# Altium project STM32F407Z.PrjPcb
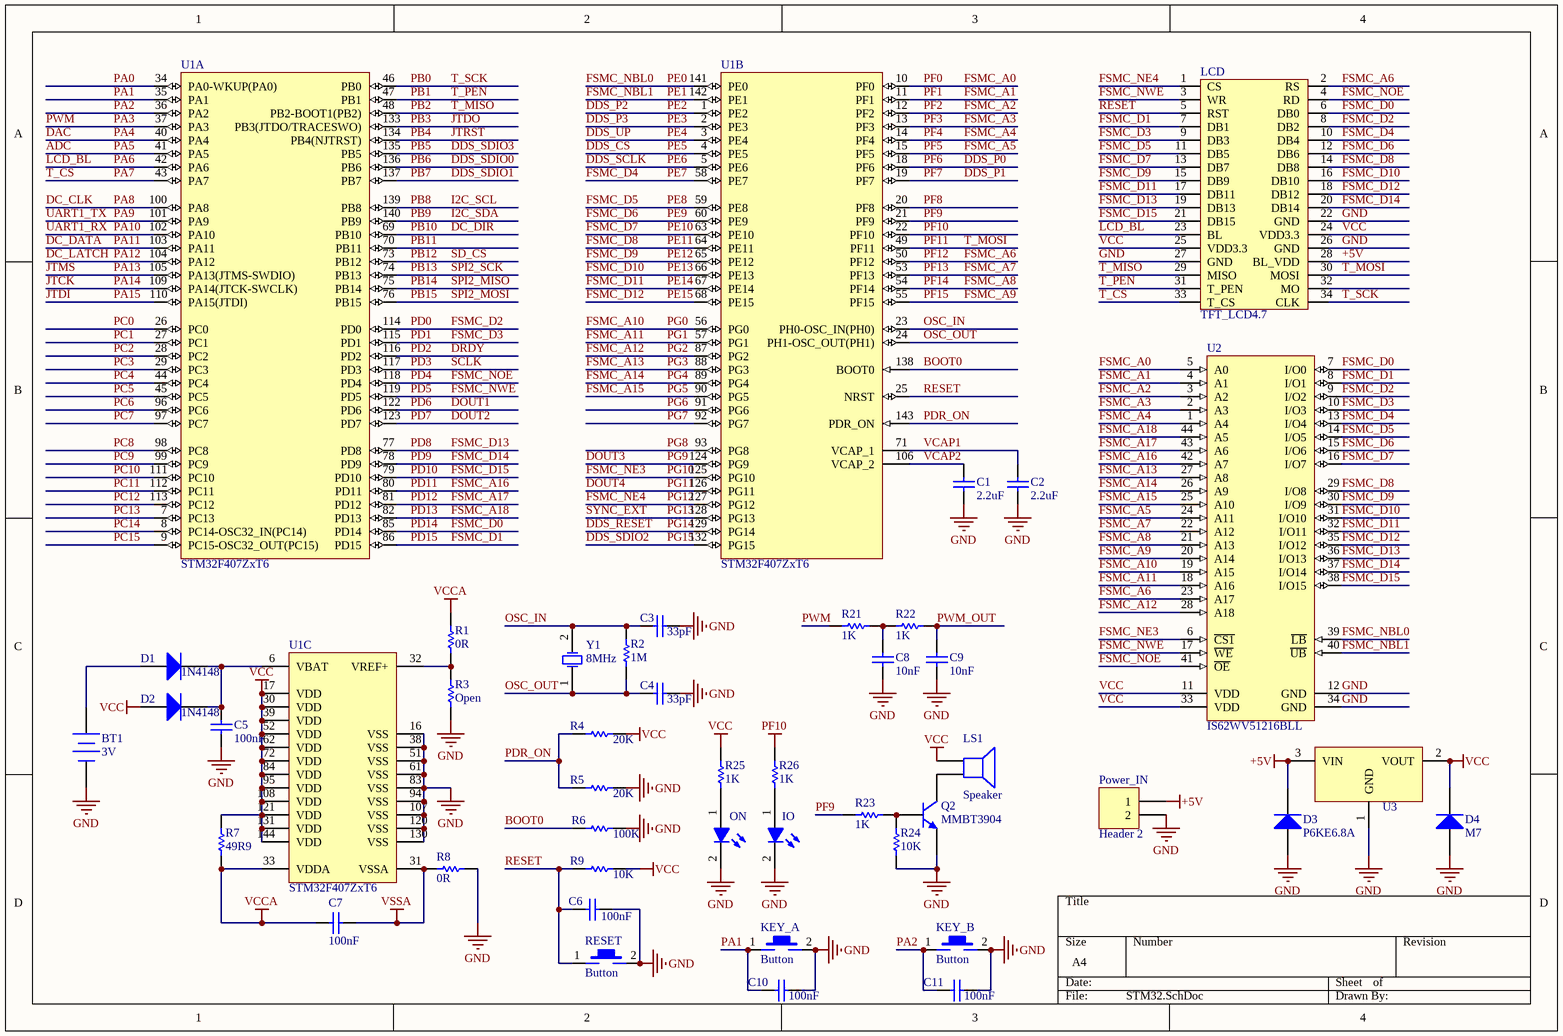
[diagram p0: STM32.SchDoc]
3 sheets, 103 parts. Net scope: global (net labels, ports and power ports of the same name join across sheets).
Board file: F407Z.PcbDoc
Sheets:
  STM32.SchDoc
  Ports.SchDoc
  Decoupling CAP.SchDoc

## Sheet STM32.SchDoc
size A4

### Parts
BT1  3V  [BAT-2]
C1  2.2uF  [CAPC0603(1608)55_M]
C2  2.2uF  [CAPC0603(1608)55_M]
C3  33pF  [CAPC0603(1608)55_M]
C4  33pF  [CAPC0603(1608)55_M]
C5  100nF  [CAPC0603(1608)55_M]
C6  100nF  [CAPC0603(1608)55_M]
C7  100nF  [CAPC0603(1608)55_M]
C8  10nF  [CAPC0603(1608)55_M]
C9  10nF  [CAPC0603(1608)55_M]
C10  100nF  [CAPC0603(1608)55_M]
C11  100nF  [CAPC0603(1608)55_M]
D1  1N4148  [LL34]
D2  1N4148  [LL34]
D3  P6KE6.8A  [DO-214AC]
D4  M7  [DO-214AC]
IO  LED-BLUE  [0603LED_BLUE_V]  (value not drawn)
KEY_A  Button  [Button665]
KEY_B  Button  [Button665]
LCD  TFT_LCD4.7  [DB2*17-3.5]
LS1  Speaker  [Buzzer]
ON  LED-BLUE  [0603LED_BLUE_V]  (value not drawn)
Power_IN  Header 2  [VH3.96-2-AW]
Q2  MMBT3904  [SOT23_M]
R1  0R  [RESC0603(1608)_M]
R2  1M  [RESC0603(1608)_M]
R3  Open  [RESC0603(1608)_M]
R4  20K  [RESC0603(1608)_M]
R5  20K  [RESC0603(1608)_M]
R6  100K  [RESC0603(1608)_M]
R7  49R9  [RESC0603(1608)_M]
R8  0R  [RESC0603(1608)_M]
R9  10K  [RESC0603(1608)_M]
R21  1K  [RESC0603(1608)_M]
R22  1K  [RESC0603(1608)_M]
R23  1K  [RESC0603(1608)_M]
R24  10K  [RESC0603(1608)_M]
R25  1K  [RESC0603(1608)_M]
R26  1K  [RESC0603(1608)_M]
RESET  Button  [Button665]
U1  STM32F407ZxT6  [LQFP144]  (parts A,B,C of 3)
U2  IS62WV51216BLL  [TSOP-2-44]
U3  AMS1117  [SOT-223_M]  (value not drawn)
Y1  8MHz  [HC-49S]

### Nets
+5V: D3.1(K) LCD.28(BL_VDD) Power_IN.1 U3.3(VIN)
GND: BT1.2(-) C1.1 C2.1 C3.2 C4.2 C5.2 C6.2 C8.1 C9.1 C10.2 C11.2 D3.2(A) D4.2(A) IO.2(K) KEY_A.2 KEY_B.2 LCD.22(GND) LCD.26(GND) LCD.27(GND) ON.2(K) Power_IN.2 Q2.2(E) R3.1 R5.1 R6.2 R8.2 R24.1 RESET.2 U1.16(VSS) U1.38(VSS) U1.51(VSS) U1.61(VSS) U1.83(VSS) U1.94(VSS) U1.107(VSS) U1.120(VSS) U1.130(VSS) U2.12(GND) U2.34(GND) U3.1(GND)
PF10: R26.2 U1.22(PF10)
VCC: D2.2(A) D4.1(K) LCD.24(VDD3.3) LCD.25(VDD3.3) LS1.1 R4.1 R7.2 R9.2 R25.2 U1.17(VDD) U1.30(VDD) U1.39(VDD) U1.52(VDD) U1.62(VDD) U1.72(VDD) U1.84(VDD) U1.95(VDD) U1.108(VDD) U1.121(VDD) U1.131(VDD) U1.144(VDD) U2.11(VDD) U2.33(VDD) U3.2(VOUT)
VCCA: C7.2 R1.2 R7.1 U1.33(VDDA)
VSSA: C7.1 R8.1 U1.31(VSSA)
ADC: U1.41(PA5)  [also labelled PA5]
BOOT0: R6.1 U1.138(BOOT0)
DAC: U1.40(PA4)  [also labelled PA4]
DC_CLK: U1.100(PA8)  [also labelled PA8]
DC_DATA: U1.103(PA11)  [also labelled PA11]
DC_DIR: U1.69(PB10)  [also labelled PB10]
DC_LATCH: U1.104(PA12)  [also labelled PA12]
DDS_CS: U1.4(PE5)  [also labelled PE5]
DDS_P0: U1.18(PF6)  [also labelled PF6]
DDS_P1: U1.19(PF7)  [also labelled PF7]
DDS_P2: U1.1(PE2)  [also labelled PE2]
DDS_P3: U1.2(PE3)  [also labelled PE3]
DDS_RESET: U1.129(PG14)  [also labelled PG14]
DDS_SCLK: U1.5(PE6)  [also labelled PE6]
DDS_SDIO0: U1.136(PB6)  [also labelled PB6]
DDS_SDIO1: U1.137(PB7)  [also labelled PB7]
DDS_SDIO2: U1.132(PG15)  [also labelled PG15]
DDS_SDIO3: U1.135(PB5)  [also labelled PB5]
DDS_UP: U1.3(PE4)  [also labelled PE4]
DOUT1: U1.122(PD6)  [also labelled PD6]
DOUT2: U1.123(PD7)  [also labelled PD7]
DOUT3: U1.124(PG9)  [also labelled PG9]
DOUT4: U1.126(PG11)  [also labelled PG11]
DRDY: U1.116(PD2)  [also labelled PD2]
FSMC_A0: U1.10(PF0) U2.5(A0)  [also labelled PF0]
FSMC_A1: U1.11(PF1) U2.4(A1)  [also labelled PF1]
FSMC_A2: U1.12(PF2) U2.3(A2)  [also labelled PF2]
FSMC_A3: U1.13(PF3) U2.2(A3)  [also labelled PF3]
FSMC_A4: U1.14(PF4) U2.1(A4)  [also labelled PF4]
FSMC_A5: U1.15(PF5) U2.24(A11)  [also labelled PF5]
FSMC_A6: LCD.2(RS) U1.50(PF12) U2.23(A17)  [also labelled PF12]
FSMC_A7: U1.53(PF13) U2.22(A12)  [also labelled PF13]
FSMC_A8: U1.54(PF14) U2.21(A13)  [also labelled PF14]
FSMC_A9: U1.55(PF15) U2.20(A14)  [also labelled PF15]
FSMC_A10: U1.56(PG0) U2.19(A15)  [also labelled PG0]
FSMC_A11: U1.57(PG1) U2.18(A16)  [also labelled PG1]
FSMC_A12: U1.87(PG2) U2.28(A18)  [also labelled PG2]
FSMC_A13: U1.88(PG3) U2.27(A8)  [also labelled PG3]
FSMC_A14: U1.89(PG4) U2.26(A9)  [also labelled PG4]
FSMC_A15: U1.90(PG5) U2.25(A10)  [also labelled PG5]
FSMC_A16: U1.80(PD11) U2.42(A7)  [also labelled PD11]
FSMC_A17: U1.81(PD12) U2.43(A6)  [also labelled PD12]
FSMC_A18: U1.82(PD13) U2.44(A5)  [also labelled PD13]
FSMC_D0: LCD.6(DB0) U1.85(PD14) U2.7(I/O0)  [also labelled PD14]
FSMC_D1: LCD.7(DB1) U1.86(PD15) U2.8(I/O1)  [also labelled PD15]
FSMC_D2: LCD.8(DB2) U1.114(PD0) U2.9(I/O2)  [also labelled PD0]
FSMC_D3: LCD.9(DB3) U1.115(PD1) U2.10(I/O3)  [also labelled PD1]
FSMC_D4: LCD.10(DB4) U1.58(PE7) U2.13(I/O4)  [also labelled PE7]
FSMC_D5: LCD.11(DB5) U1.59(PE8) U2.14(I/O5)  [also labelled PE8]
FSMC_D6: LCD.12(DB6) U1.60(PE9) U2.15(I/O6)  [also labelled PE9]
FSMC_D7: LCD.13(DB7) U1.63(PE10) U2.16(I/O7)  [also labelled PE10]
FSMC_D8: LCD.14(DB8) U1.64(PE11) U2.29(I/O8)  [also labelled PE11]
FSMC_D9: LCD.15(DB9) U1.65(PE12) U2.30(I/O9)  [also labelled PE12]
FSMC_D10: LCD.16(DB10) U1.66(PE13) U2.31(I/O10)  [also labelled PE13]
FSMC_D11: LCD.17(DB11) U1.67(PE14) U2.32(I/O11)  [also labelled PE14]
FSMC_D12: LCD.18(DB12) U1.68(PE15) U2.35(I/O12)  [also labelled PE15]
FSMC_D13: LCD.19(DB13) U1.77(PD8) U2.36(I/O13)  [also labelled PD8]
FSMC_D14: LCD.20(DB14) U1.78(PD9) U2.37(I/O14)  [also labelled PD9]
FSMC_D15: LCD.21(DB15) U1.79(PD10) U2.38(I/O15)  [also labelled PD10]
FSMC_NBL0: U1.141(PE0) U2.39(~{LB})  [also labelled PE0]
FSMC_NBL1: U1.142(PE1) U2.40(~{UB})  [also labelled PE1]
FSMC_NE3: U1.125(PG10) U2.6(~{CS1})  [also labelled PG10]
FSMC_NE4: LCD.1(CS) U1.127(PG12)  [also labelled PG12]
FSMC_NOE: LCD.4(RD) U1.118(PD4) U2.41(~{OE})  [also labelled PD4]
FSMC_NWE: LCD.3(WR) U1.119(PD5) U2.17(~{WE})  [also labelled PD5]
I2C_SCL: U1.139(PB8)  [also labelled PB8]
I2C_SDA: U1.140(PB9)  [also labelled PB9]
JTCK: U1.109(PA14(JTCK-SWCLK))  [also labelled PA14]
JTDI: U1.110(PA15(JTDI))  [also labelled PA15]
JTDO: U1.133(PB3(JTDO/TRACESWO))  [also labelled PB3]
JTMS: U1.105(PA13(JTMS-SWDIO))  [also labelled PA13]
JTRST: U1.134(PB4(NJTRST))  [also labelled PB4]
LCD_BL: LCD.23(BL) U1.42(PA6)  [also labelled PA6]
OSC_IN: C3.1 R2.2 U1.23(PH0-OSC_IN(PH0)) Y1.2(OSC2)
OSC_OUT: C4.1 R2.1 U1.24(PH1-OSC_OUT(PH1)) Y1.1(OSC1)
PA0: U1.34(PA0-WKUP(PA0))
PA1: C10.1 KEY_A.1 U1.35(PA1)
PA2: C11.1 KEY_B.1 U1.36(PA2)
PA3: R21.1 U1.37(PA3)  [also labelled PWM]
PA7: LCD.33(T_CS) U1.43(PA7)  [also labelled T_CS]
PA9: U1.101(PA9)  [also labelled UART1_TX]
PA10: U1.102(PA10)  [also labelled UART1_RX]
PB0: LCD.34(CLK) U1.46(PB0)  [also labelled T_SCK]
PB1: LCD.31(T_PEN) U1.47(PB1)  [also labelled T_PEN]
PB2: LCD.29(MISO) U1.48(PB2-BOOT1(PB2))  [also labelled T_MISO]
PB11: U1.70(PB11)
PB12: U1.73(PB12)  [also labelled SD_CS]
PB13: U1.74(PB13)  [also labelled SPI2_SCK]
PB14: U1.75(PB14)  [also labelled SPI2_MISO]
PB15: U1.76(PB15)  [also labelled SPI2_MOSI]
PC0: U1.26(PC0)
PC1: U1.27(PC1)
PC2: U1.28(PC2)
PC3: U1.29(PC3)
PC4: U1.44(PC4)
PC5: U1.45(PC5)
PC6: U1.96(PC6)
PC7: U1.97(PC7)
PC8: U1.98(PC8)
PC9: U1.99(PC9)
PC10: U1.111(PC10)
PC11: U1.112(PC11)
PC12: U1.113(PC12)
PC13: U1.7(PC13)
PC14: U1.8(PC14-OSC32_IN(PC14))
PC15: U1.9(PC15-OSC32_OUT(PC15))
PD3: U1.117(PD3)  [also labelled SCLK]
PDR_ON: R4.2 R5.2 U1.143(PDR_ON)
PF8: U1.20(PF8)
PF9: R23.1 U1.21(PF9)
PF11: LCD.30(MOSI) U1.49(PF11)  [also labelled T_MOSI]
PG6: U1.91(PG6)
PG7: U1.92(PG7)
PG8: U1.93(PG8)
PG13: U1.128(PG13)  [also labelled SYNC_EXT]
PWM_OUT: C9.2 R22.2
RESET: C6.1 LCD.5(RST) R9.1 RESET.1 U1.25(NRST)
VCAP1: C2.2 U1.71(VCAP_1)
VCAP2: C1.2 U1.106(VCAP_2)
NetBT1_1: BT1.1(+) D1.2(A)
NetC5_1: C5.1 D1.1(K) D2.1(K) U1.6(VBAT)
NetC8_2: C8.2 R21.2 R22.1
NetIO_1: IO.1(A) R26.1
NetLS1_2: LS1.2 Q2.3(C)
NetON_1: ON.1(A) R25.1
NetQ2_1: Q2.1(B) R23.2 R24.2
NetR1_1: R1.1 R3.2 U1.32(VREF+)

Not connected (* = marked no-connect by the designer): LCD 32(MO)

### Library data of the parts
BT1 = Battery: Multicell Battery; Published: 24-Mar-1999; LatestRevisionDate: 17-Jul-2002; LatestRevisionNote: Re-released for DXP Platform.; PackageReference: BAT-2; Publisher: Altium Limited; PackageDescription: Battery; 2 Leads
C1-C11 = CAP
D1-D4 = Diode: pin to pad: 1>2 2>1
LS1 = Speaker: Loudspeaker; Published: 24-Mar-1999; LatestRevisionDate: 17-Jul-2002; LatestRevisionNote: Re-released for DXP Platform.; PackageReference: PIN2; Publisher: Altium Limited
Power_IN = Header 2: Header, 2-Pin; LatestRevisionDate: 17-Jul-2002; LatestRevisionNote: Re-released for DXP Platform.; Publisher: Altium Limited
Q2 = MMBT3904: NPN General Purpose Amplifier; Published: 8-Jun-2000; LatestRevisionDate: 15-Jan-2003; LatestRevisionNote: PCB Footprint 'BCY-W3/D4.7' replaced; DatasheetVersion: 1997; PackageVersion: Sep-1998; PackageReference: TO-92A; Publisher: Altium Limited; PackageDescription: TO, Flat Index; 3 In-Line, Axial Leads; Body Dia. 4.5mm; Leads 0.51 x 0.48 mm (max); ComponentLink1Description: Manufacturer Link; ComponentLink1URL: http://www.fairchildsemi.com/; ComponentLink2Description: Datasheet; ComponentLink2URL: http://www.fairchildsemi.com/ds/2N%2F2N3904.pdf
R1-R9 R21-R26 = RES
Y1 = XTAL: Crystal Oscillator; Published: 8-Jun-2000; LatestRevisionDate: 17-Jul-2002; LatestRevisionNote: Re-released for DXP Platform.; PackageReference: R38; Publisher: Altium Limited; PackageDescription: Crystal, Thru-Hole; 2 Leads; Body 3.1 x 8.2 mm (Dia.xH)

## Sheet Ports.SchDoc
size A4
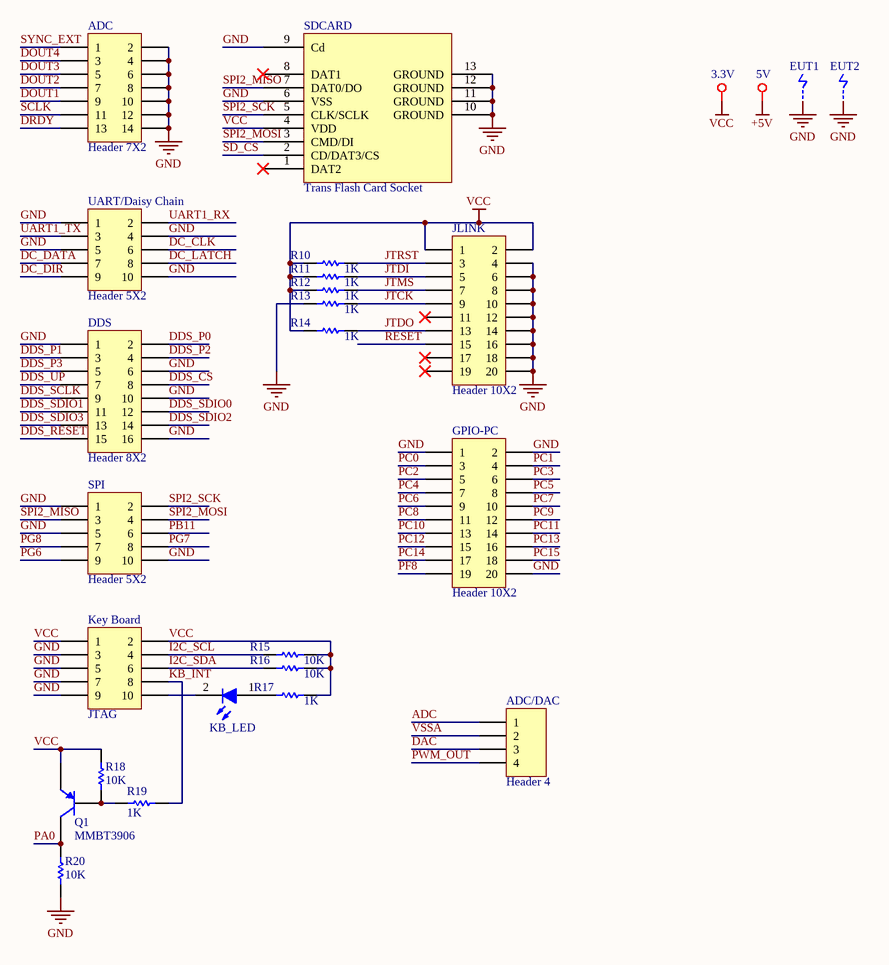
[diagram p1: Ports.SchDoc]

### Parts
3.3V  TestPoint  [TestHole]  (value not drawn)
5V  TestPoint  [TestHole]  (value not drawn)
ADC  Header 7X2  [HEADER7X2]
ADC/DAC  Header 4  [HDR1X4]
DDS  Header 8X2  [HEADER8X2]
EUT1  EUT  [EUT]  (value not drawn)
EUT2  EUT  [EUT]  (value not drawn)
GPIO-PC  Header 10X2  [HEADER 10X2]
JLINK  Header 10X2  [HEADER 10X2]
KB_LED  LED-BLUE  [0603LED_BLUE_V]  (value not drawn)
Key_Board  JTAG  [HEADER5X2]
Q1  MMBT3906  [SOT23_M]
R10  1K  [RESC0603(1608)_M]
R11  1K  [RESC0603(1608)_M]
R12  1K  [RESC0603(1608)_M]
R13  1K  [RESC0603(1608)_M]
R14  1K  [RESC0603(1608)_M]
R15  10K  [RESC0603(1608)_M]
R16  10K  [RESC0603(1608)_M]
R17  1K  [RESC0603(1608)_M]
R18  10K  [RESC0603(1608)_M]
R19  1K  [RESC0603(1608)_M]
R20  10K  [RESC0603(1608)_M]
SDCARD  Trans Flash Card Socket  [TF Card]
SPI  Header 5X2  [HEADER5X2]
UART/Daisy_Chain  Header 5X2  [HEADER5X2]

### Nets
+5V: 5V.1
GND: ADC.2 ADC.4 ADC.6 ADC.8 ADC.10 ADC.12 ADC.14 DDS.1 DDS.6 DDS.10 DDS.16 EUT1.2 EUT2.2 GPIO-PC.1 GPIO-PC.2 GPIO-PC.20 JLINK.4 JLINK.6 JLINK.8 JLINK.10 JLINK.12 JLINK.14 JLINK.16 JLINK.18 JLINK.20 Key_Board.3 Key_Board.5 Key_Board.7 Key_Board.9 R13.1 R20.1 SDCARD.6(VSS) SDCARD.9(Cd) SDCARD.10(GROUND) SDCARD.11(GROUND) SDCARD.12(GROUND) SDCARD.13(GROUND) SPI.1 SPI.5 SPI.10 UART/Daisy_Chain.1 UART/Daisy_Chain.4 UART/Daisy_Chain.5 UART/Daisy_Chain.10
VCC: 3.3V.1 JLINK.1 JLINK.2 Key_Board.1 Key_Board.2 Q1.2(E) R10.1 R11.1 R12.1 R14.1 R15.2 R16.2 R17.2 R18.2 SDCARD.4(VDD)
VSSA: ADC/DAC.2
ADC: ADC/DAC.1
DAC: ADC/DAC.3
DC_CLK: UART/Daisy_Chain.6
DC_DATA: UART/Daisy_Chain.7
DC_DIR: UART/Daisy_Chain.9
DC_LATCH: UART/Daisy_Chain.8
DDS_CS: DDS.8
DDS_P0: DDS.2
DDS_P1: DDS.3
DDS_P2: DDS.4
DDS_P3: DDS.5
DDS_RESET: DDS.15
DDS_SCLK: DDS.9
DDS_SDIO0: DDS.12
DDS_SDIO1: DDS.11
DDS_SDIO2: DDS.14
DDS_SDIO3: DDS.13
DDS_UP: DDS.7
DOUT1: ADC.9
DOUT2: ADC.7
DOUT3: ADC.5
DOUT4: ADC.3
DRDY: ADC.13
I2C_SCL: Key_Board.4 R15.1
I2C_SDA: Key_Board.6 R16.1
JTCK: JLINK.9 R13.2
JTDI: JLINK.5 R11.2
JTDO: JLINK.13 R14.2
JTMS: JLINK.7 R12.2
JTRST: JLINK.3 R10.2
KB_INT: Key_Board.8 R19.2
PA0: Q1.3(C) R20.2
PB11: SPI.6
PC0: GPIO-PC.3
PC1: GPIO-PC.4
PC2: GPIO-PC.5
PC3: GPIO-PC.6
PC4: GPIO-PC.7
PC5: GPIO-PC.8
PC6: GPIO-PC.9
PC7: GPIO-PC.10
PC8: GPIO-PC.11
PC9: GPIO-PC.12
PC10: GPIO-PC.13
PC11: GPIO-PC.14
PC12: GPIO-PC.15
PC13: GPIO-PC.16
PC14: GPIO-PC.17
PC15: GPIO-PC.18
PF8: GPIO-PC.19
PG6: SPI.9
PG7: SPI.8
PG8: SPI.7
PWM_OUT: ADC/DAC.4
RESET: JLINK.15
SCLK: ADC.11  [project net PD3]
SD_CS: SDCARD.2(CD/DAT3/CS)  [project net PB12]
SPI2_MISO: SDCARD.7(DAT0/DO) SPI.3  [project net PB14]
SPI2_MOSI: SDCARD.3(CMD/DI) SPI.4  [project net PB15]
SPI2_SCK: SDCARD.5(CLK/SCLK) SPI.2  [project net PB13]
SYNC_EXT: ADC.1  [project net PG13]
UART1_RX: UART/Daisy_Chain.2  [project net PA10]
UART1_TX: UART/Daisy_Chain.3  [project net PA9]
NetKB_LED_1: KB_LED.1(A) R17.1
NetKB_LED_2: KB_LED.2(K) Key_Board.10
NetQ1_1: Q1.1(B) R18.1 R19.1

Not connected (* = marked no-connect by the designer): JLINK 11* 17* 19*; SDCARD 1(DAT2)* 8(DAT1)*

### Library data of the parts
ADC = Header 7X2: Header, 7-Pin, Dual row; LatestRevisionDate: 17-Jul-2002; LatestRevisionNote: Re-released for DXP Platform.; Publisher: Altium Limited
ADC/DAC = Header 4: Header, 4-Pin; LatestRevisionDate: 17-Jul-2002; LatestRevisionNote: Re-released for DXP Platform.; Publisher: Altium Limited
DDS = Header 8X2: Header, 8-Pin, Dual row; LatestRevisionDate: 17-Jul-2002; LatestRevisionNote: Re-released for DXP Platform.; Publisher: Altium Limited
GPIO-PC JLINK = Header 10X2: Header, 10-Pin, Dual row; LatestRevisionDate: 17-Jul-2002; LatestRevisionNote: Re-released for DXP Platform.; Publisher: Altium Limited
Key_Board = Header 5X2: Header, 5-Pin, Dual row; Manufacturer: Generic Components; Class: Connector
Q1 = MMBT3906: PNP General Purpose Amplifier; Published: 8-Jun-2000; LatestRevisionDate: 15-Jan-2003; LatestRevisionNote: PCB Footprint 'BCY-W3/D4.7' replaced; DatasheetVersion: 1997; PackageVersion: Sep-1998; PackageReference: TO-92A; Publisher: Altium Limited; PackageDescription: TO, Flat Index; 3 In-Line, Axial Leads; Body Dia. 4.5mm; Leads 0.51 x 0.48 mm (max); ComponentLink1Description: Manufacturer Link; ComponentLink1URL: http://www.fairchildsemi.com/; ComponentLink2Description: Datasheet; ComponentLink2URL: http://www.fairchildsemi.com/ds/2N%2F2N3906.pdf
R10-R20 = RES
SDCARD = Trans Flash Card
SPI UART/Daisy_Chain = Header 5X2: Header, 5-Pin, Dual row; LatestRevisionDate: 17-Jul-2002; LatestRevisionNote: Re-released for DXP Platform.; Publisher: Altium Limited

## Sheet Decoupling CAP.SchDoc
size A4
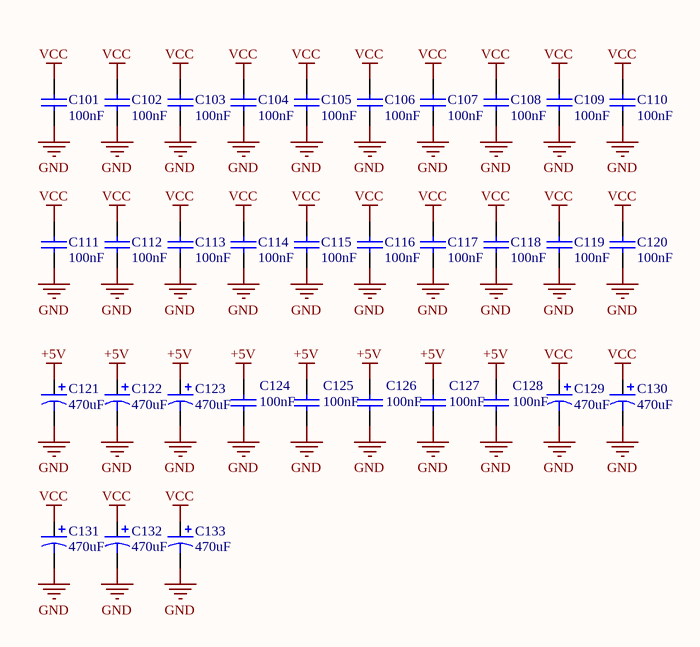
[diagram p2: Decoupling CAP.SchDoc]

### Parts
C101  100nF  [CAPC0603(1608)55_M]
C102  100nF  [CAPC0603(1608)55_M]
C103  100nF  [CAPC0603(1608)55_M]
C104  100nF  [CAPC0603(1608)55_M]
C105  100nF  [CAPC0603(1608)55_M]
C106  100nF  [CAPC0603(1608)55_M]
C107  100nF  [CAPC0603(1608)55_M]
C108  100nF  [CAPC0603(1608)55_M]
C109  100nF  [CAPC0603(1608)55_M]
C110  100nF  [CAPC0603(1608)55_M]
C111  100nF  [CAPC0603(1608)55_M]
C112  100nF  [CAPC0603(1608)55_M]
C113  100nF  [CAPC0603(1608)55_M]
C114  100nF  [CAPC0603(1608)55_M]
C115  100nF  [CAPC0603(1608)55_M]
C116  100nF  [CAPC0603(1608)55_M]
C117  100nF  [CAPC0603(1608)55_M]
C118  100nF  [CAPC0603(1608)55_M]
C119  100nF  [CAPC0603(1608)55_M]
C120  100nF  [CAPC0603(1608)55_M]
C121  470uF  [CAPC7343]
C122  470uF  [CAPC7343]
C123  470uF  [CAPC7343]
C124  100nF  [CAPC0603(1608)55_M]
C125  100nF  [CAPC0603(1608)55_M]
C126  100nF  [CAPC0603(1608)55_M]
C127  100nF  [CAPC0603(1608)55_M]
C128  100nF  [CAPC0603(1608)55_M]
C129  470uF  [CAPC7343]
C130  470uF  [CAPC7343]
C131  470uF  [CAPC7343]
C132  470uF  [CAPC7343]
C133  470uF  [CAPC7343]

### Nets
+5V: C121.1 C122.1 C123.1 C124.2 C125.2 C126.2 C127.2 C128.2
GND: C101.1 C102.1 C103.1 C104.1 C105.1 C106.1 C107.1 C108.1 C109.1 C110.1 C111.1 C112.1 C113.1 C114.1 C115.1 C116.1 C117.1 C118.1 C119.1 C120.1 C121.2 C122.2 C123.2 C124.1 C125.1 C126.1 C127.1 C128.1 C129.2 C130.2 C131.2 C132.2 C133.2
VCC: C101.2 C102.2 C103.2 C104.2 C105.2 C106.2 C107.2 C108.2 C109.2 C110.2 C111.2 C112.2 C113.2 C114.2 C115.2 C116.2 C117.2 C118.2 C119.2 C120.2 C129.1 C130.1 C131.1 C132.1 C133.1

### Library data of the parts
C101-C120 C124-C128 = CAP
C121-C123 C129-C133 = CAP-Pol

## Nets that join several sheets
+5V: STM32 (D3.1 LCD.28 Power_IN.1 U3.3), Ports (5V.1), Decoupling CAP (8 pins)
GND: STM32 (40 pins), Ports (44 pins), Decoupling CAP (33 pins)
VCC: STM32 (24 pins), Ports (15 pins), Decoupling CAP (25 pins)
VSSA: STM32 (C7.1 R8.1 U1.31), Ports (ADC/DAC.2)
ADC: STM32 (U1.41), Ports (ADC/DAC.1)
DAC: STM32 (U1.40), Ports (ADC/DAC.3)
DC_CLK: STM32 (U1.100), Ports (UART/Daisy_Chain.6)
DC_DATA: STM32 (U1.103), Ports (UART/Daisy_Chain.7)
DC_DIR: STM32 (U1.69), Ports (UART/Daisy_Chain.9)
DC_LATCH: STM32 (U1.104), Ports (UART/Daisy_Chain.8)
DDS_CS: STM32 (U1.4), Ports (DDS.8)
DDS_P0: STM32 (U1.18), Ports (DDS.2)
DDS_P1: STM32 (U1.19), Ports (DDS.3)
DDS_P2: STM32 (U1.1), Ports (DDS.4)
DDS_P3: STM32 (U1.2), Ports (DDS.5)
DDS_RESET: STM32 (U1.129), Ports (DDS.15)
DDS_SCLK: STM32 (U1.5), Ports (DDS.9)
DDS_SDIO0: STM32 (U1.136), Ports (DDS.12)
DDS_SDIO1: STM32 (U1.137), Ports (DDS.11)
DDS_SDIO2: STM32 (U1.132), Ports (DDS.14)
DDS_SDIO3: STM32 (U1.135), Ports (DDS.13)
DDS_UP: STM32 (U1.3), Ports (DDS.7)
DOUT1: STM32 (U1.122), Ports (ADC.9)
DOUT2: STM32 (U1.123), Ports (ADC.7)
DOUT3: STM32 (U1.124), Ports (ADC.5)
DOUT4: STM32 (U1.126), Ports (ADC.3)
DRDY: STM32 (U1.116), Ports (ADC.13)
I2C_SCL: STM32 (U1.139), Ports (Key_Board.4 R15.1)
I2C_SDA: STM32 (U1.140), Ports (Key_Board.6 R16.1)
JTCK: STM32 (U1.109), Ports (JLINK.9 R13.2)
JTDI: STM32 (U1.110), Ports (JLINK.5 R11.2)
JTDO: STM32 (U1.133), Ports (JLINK.13 R14.2)
JTMS: STM32 (U1.105), Ports (JLINK.7 R12.2)
JTRST: STM32 (U1.134), Ports (JLINK.3 R10.2)
PA0: STM32 (U1.34), Ports (Q1.3 R20.2)
PA9: STM32 (U1.101), Ports (UART/Daisy_Chain.3)
PA10: STM32 (U1.102), Ports (UART/Daisy_Chain.2)
PB11: STM32 (U1.70), Ports (SPI.6)
PB12: STM32 (U1.73), Ports (SDCARD.2)
PB13: STM32 (U1.74), Ports (SDCARD.5 SPI.2)
PB14: STM32 (U1.75), Ports (SDCARD.7 SPI.3)
PB15: STM32 (U1.76), Ports (SDCARD.3 SPI.4)
PC0: STM32 (U1.26), Ports (GPIO-PC.3)
PC1: STM32 (U1.27), Ports (GPIO-PC.4)
PC2: STM32 (U1.28), Ports (GPIO-PC.5)
PC3: STM32 (U1.29), Ports (GPIO-PC.6)
PC4: STM32 (U1.44), Ports (GPIO-PC.7)
PC5: STM32 (U1.45), Ports (GPIO-PC.8)
PC6: STM32 (U1.96), Ports (GPIO-PC.9)
PC7: STM32 (U1.97), Ports (GPIO-PC.10)
PC8: STM32 (U1.98), Ports (GPIO-PC.11)
PC9: STM32 (U1.99), Ports (GPIO-PC.12)
PC10: STM32 (U1.111), Ports (GPIO-PC.13)
PC11: STM32 (U1.112), Ports (GPIO-PC.14)
PC12: STM32 (U1.113), Ports (GPIO-PC.15)
PC13: STM32 (U1.7), Ports (GPIO-PC.16)
PC14: STM32 (U1.8), Ports (GPIO-PC.17)
PC15: STM32 (U1.9), Ports (GPIO-PC.18)
PD3: STM32 (U1.117), Ports (ADC.11)
PF8: STM32 (U1.20), Ports (GPIO-PC.19)
PG6: STM32 (U1.91), Ports (SPI.9)
PG7: STM32 (U1.92), Ports (SPI.8)
PG8: STM32 (U1.93), Ports (SPI.7)
PG13: STM32 (U1.128), Ports (ADC.1)
PWM_OUT: STM32 (C9.2 R22.2), Ports (ADC/DAC.4)
RESET: STM32 (5 pins), Ports (JLINK.15)